# EAGLE design LeftRightTurretLRUD (EAGLE 9.5.1)
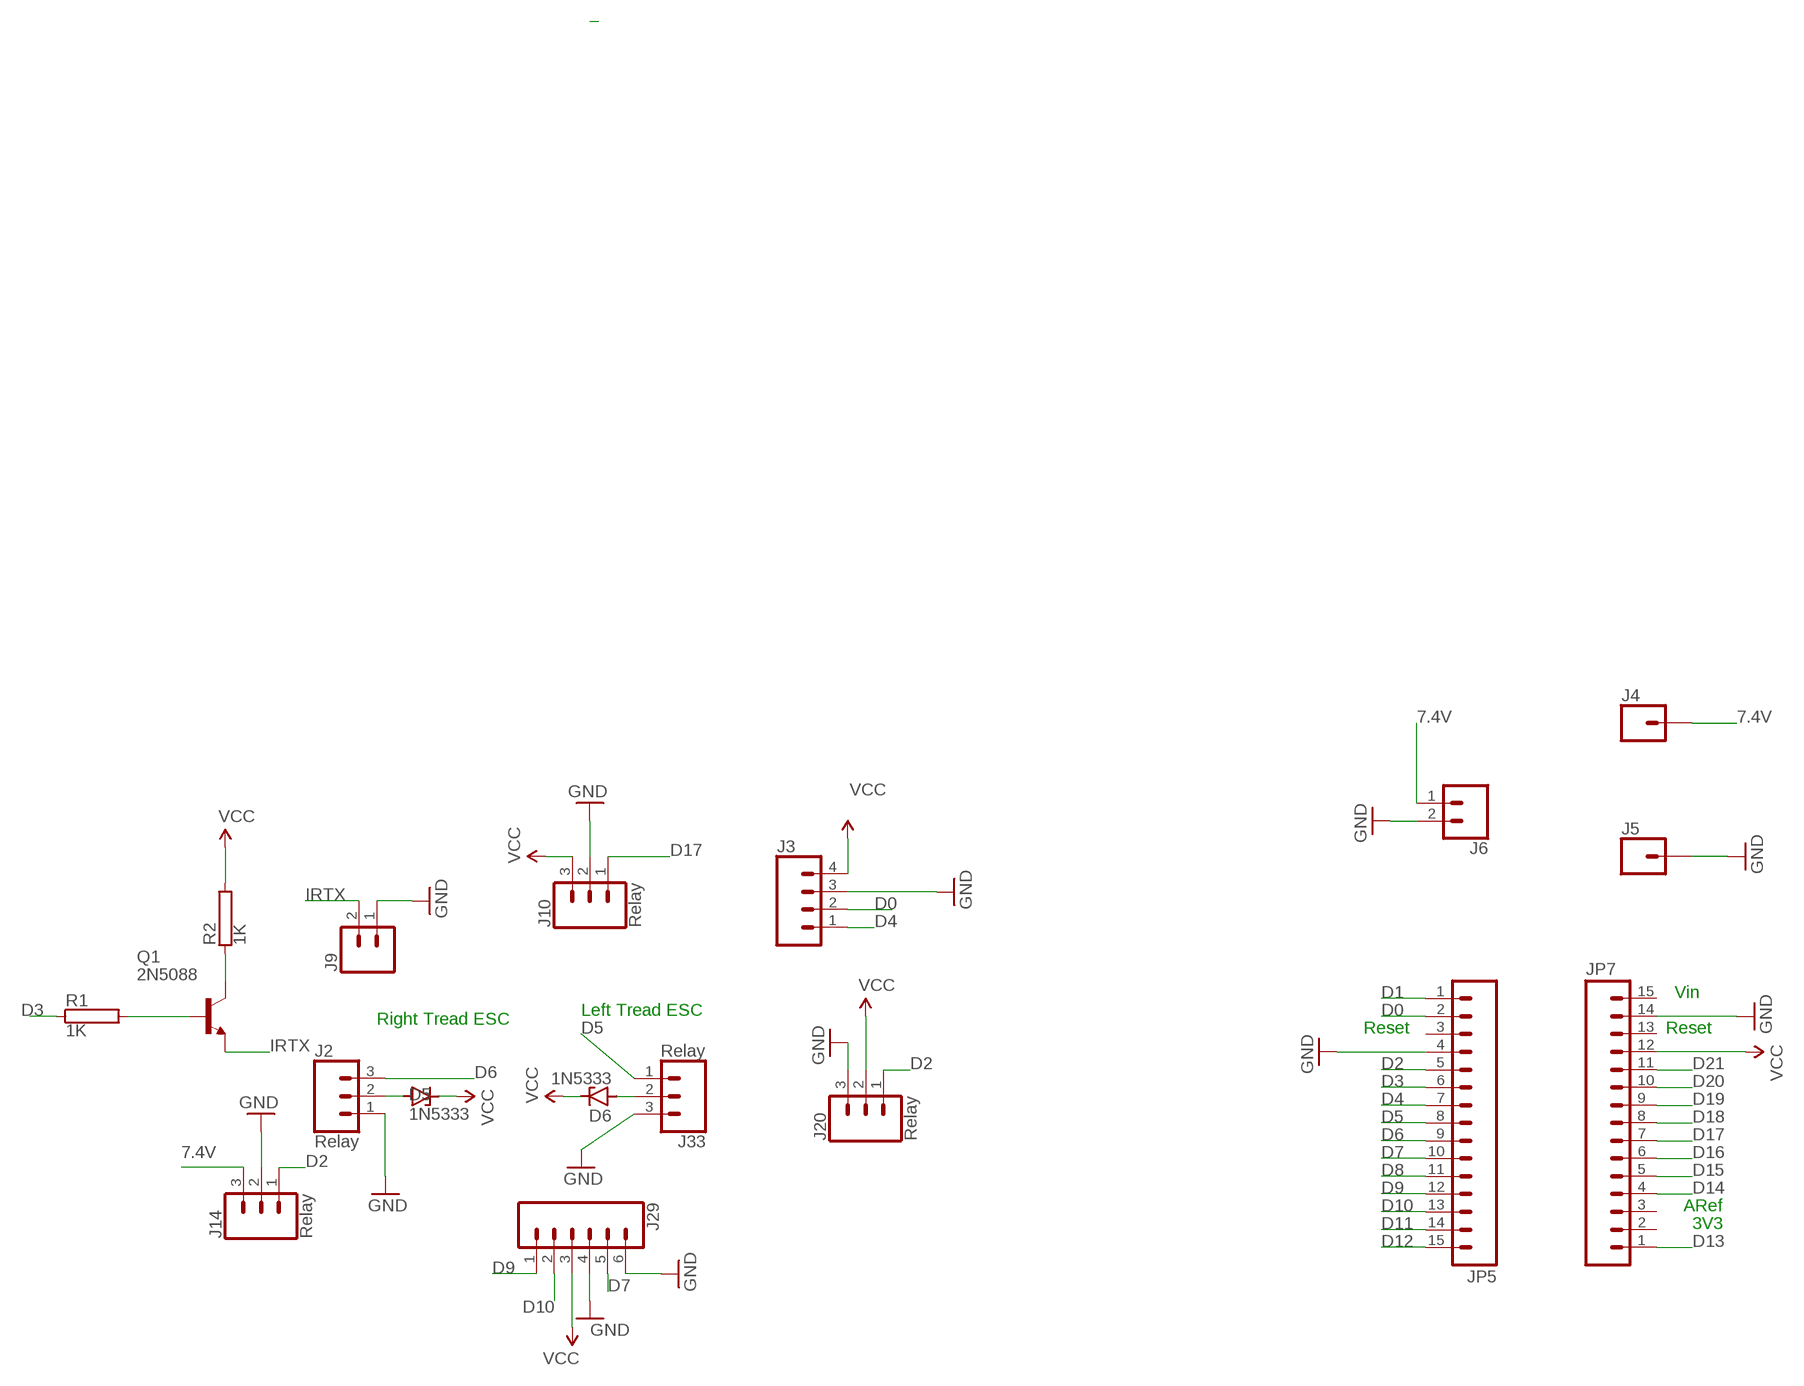
[diagram p0: schematic, sheet 1]

## Parts
D5  1N5333  [C1702-15]
D6  1N5333  [C1702-15]
J2  Relay  CONN_03  [1X03]
J3  CONN_04  [1X04]
J4  CONN_01  [1X01]
J5  CONN_01  [1X01]
J6  CONN_02  [1X02]
J9  CONN_02  [1X02]
J10  Relay  CONN_03  [1X03]
J14  Relay  CONN_03  [1X03]
J20  Relay  CONN_03  [1X03]
J29  CONN_06NO_SILK_FEMALE_PTH  [1X06_NO_SILK]
J33  Relay  CONN_03  [1X03]
JP5  M15  [1X15@1]
JP7  M15  [1X15@1]
Q1  2N5088  [TO92]
R1  1K  RCA0001  [CA0001]
R2  1K  RCA0001  [CA0001]

## Nets
7.4V: J4.1 J6.1 J14.3
D0: J3.2 JP5.2
D1: JP5.1
D2: J14.1 J20.1 JP5.5
D3: JP5.6 R1.1
D4: J3.1 JP5.7
D5: J33.1 JP5.8
D6: J2.3 JP5.9
D7: J29.5 JP5.10
D8: JP5.11
D9: J29.1 JP5.12
D10: J29.2 JP5.13
D11: JP5.14
D12: JP5.15
D13: JP7.1
D14: JP7.4
D15: JP7.5
D16: JP7.6
D17: J10.1 JP7.7
D18: JP7.8
D19: JP7.9
D20: JP7.10
D21: JP7.11
GND [gnd]: J2.1 J3.3 J5.1 J6.2 J9.1 J10.2 J14.2 J20.3 J29.4 J29.6 J33.3 JP5.4 JP7.14
IRTX: J9.2 Q1.3(E)
N$1: Q1.2(B) R1.2
N$3: Q1.1(C) R2.1
N$7: D5.A J2.2
N$8: D6.A J33.2
VCC: D5.C D6.C J3.4 J10.3 J20.2 J29.3 JP7.12 R2.2
Unconnected: JP5.3 JP7.2 JP7.3 JP7.13 JP7.15

## Notes on the sheet
- Vin
- Left Tread ESC
- Right Tread ESC
- Reset | Reset
- ARef
- 3V3

## Library data of the parts
D5 D6 = diode:1N5333: Z DIODE 3.3 V, 5W, 5 percent (Motorola)
J2 J10 J14 J20 J33 = SparkFun-Connectors:CONN_03: Multi connection point. Often used as Generic Header-pin footprint for 0.1 inch spaced/style header connections On any of the 0.1 inch spaced packages, you can populate with these: Break Away Headers - Straight <https://www.sparkfun.com/products/116> (PRT-00116) Break Away Male Headers - Right Angle <https://www.sparkfun.com/products/553> (PRT-00553) Female Headers <https://www.sparkfun.com/products/115> (PRT-00115) Break Away Headers - Machine Pin <https://www.sparkfun.com/products/117> (PRT-00117) Break Away Female Headers - Swiss Machine Pin <https://www.sparkfun.com/products/743> (PRT-00743) Stackable Header - 3 Pin (Female, 0.1") <https://www.sparkfun.com/products/13875> (PRT-13875) For SCREWTERMINALS and SPRING TERMINALS visit here: Screw Terimnals on SparkFun.com <https://www.sparkfun.com/search/results?term=Screw+Terminals> (5mm/3.5mm/2.54mm spacing) This device is also useful as a general connection point to wire up your design to another part of your project. Our various solder wires solder well into these plated through hole pads. Hook-Up Wire - Assortment (Stranded, 22 AWG) <https://www.sparkfun.com/products/11375> (PRT-11375) Hook-Up Wire - Assortment (Solid Core, 22 AWG) <https://www.sparkfun.com/products/11367> (PRT-11367) View the entire wire category on our website here <https://www.sparkfun.com/categories/141> Special notes: Molex polarized connector foot print use with SKU : PRT-08232 with associated crimp pins and housings.; PROD_ID: XXX-00000; VALUE: 455-1750-1-ND
J3 = SparkFun-Connectors:CONN_04: Multi connection point. Often used as Generic Header-pin footprint for 0.1 inch spaced/style header connections On any of the 0.1 inch spaced packages, you can populate with these: Break Away Headers - Straight <https://www.sparkfun.com/products/116> (PRT-00116) Break Away Male Headers - Right Angle <https://www.sparkfun.com/products/553> (PRT-00553) Female Headers <https://www.sparkfun.com/products/115> (PRT-00115) Break Away Headers - Machine Pin <https://www.sparkfun.com/products/117> (PRT-00117) Break Away Female Headers - Swiss Machine Pin <https://www.sparkfun.com/products/743> (PRT-00743) For SCREWTERMINALS and SPRING TERMINALS visit here: Screw Terimnals on SparkFun.com <https://www.sparkfun.com/search/results?term=Screw+Terminals> (5mm/3.5mm/2.54mm spacing) This device is also useful as a general connection point to wire up your design to another part of your project. Our various solder wires solder well into these plated through hole pads. Hook-Up Wire - Assortment (Stranded, 22 AWG) <https://www.sparkfun.com/products/11375> (PRT-11375) Hook-Up Wire - Assortment (Solid Core, 22 AWG) <https://www.sparkfun.com/products/11367> (PRT-11367) View the entire wire category on our website here <https://www.sparkfun.com/categories/141> Special notes: Molex polarized connector foot print use with SKU : PRT-08231 with associated crimp pins and housings. 1MM SMD Version SKU: PRT-10208; PROD_ID: CONN-09696
J4 J5 = SparkFun-Connectors:CONN_01: Single connection point. Often used as Generic Header-pin footprint for 0.1 inch spaced/style header connections On any of the 0.1 inch spaced packages, you can populate with these: Break Away Headers - Straight <https://www.sparkfun.com/products/116> (PRT-00116) Break Away Male Headers - Right Angle <https://www.sparkfun.com/products/553> (PRT-00553) Female Headers <https://www.sparkfun.com/products/115> (PRT-00115) Break Away Headers - Machine Pin <https://www.sparkfun.com/products/117> (PRT-00117) Break Away Female Headers - Swiss Machine Pin <https://www.sparkfun.com/products/743> (PRT-00743) This device is also useful as a general connection point to wire up your design to another part of your project. Our various solder wires solder well into these plated through hole pads. Hook-Up Wire - Assortment (Stranded, 22 AWG) <https://www.sparkfun.com/products/11375> (PRT-11375) Hook-Up Wire - Assortment (Solid Core, 22 AWG) <https://www.sparkfun.com/products/11367> (PRT-11367) View the entire wire category on our website here <https://www.sparkfun.com/categories/141> Special notes: SMTSO-256-ET is a "flush mount" nut for a 4-40 screw. We mostly use this on specialty testbeds; it is a nice way to connect hardware to your PCB at an adjustable hieght. Also note, the SNAP packages are for using a snappable style connector. We sell a baggie of snaps and they are also used on two LilyPad designs: Snap Assortment - 30 pack (male and female) <https://www.sparkfun.com/products/11347> (DEV-11347) LilyPad Arduino SimpleSnap <https://www.sparkfun.com/products/10941> (DEV-10941) LilyPad SimpleSnap Protoboard <https://www.sparkfun.com/products/10940> (DEV-10940)
J6 J9 = SparkFun-Connectors:CONN_02: Multi connection point. Often used as Generic Header-pin footprint for 0.1 inch spaced/style header connections On any of the 0.1 inch spaced packages, you can populate with these: Break Away Headers - Straight <https://www.sparkfun.com/products/116> (PRT-00116) Break Away Male Headers - Right Angle <https://www.sparkfun.com/products/553> (PRT-00553) Female Headers <https://www.sparkfun.com/products/115> (PRT-00115) Break Away Headers - Machine Pin <https://www.sparkfun.com/products/117> (PRT-00117) Break Away Female Headers - Swiss Machine Pin <https://www.sparkfun.com/products/743> (PRT-00743) For SCREWTERMINALS and SPRING TERMINALS visit here: Screw Terimnals on SparkFun.com <https://www.sparkfun.com/search/results?term=Screw+Terminals> (5mm/3.5mm/2.54mm spacing) This device is also useful as a general connection point to wire up your design to another part of your project. Our various solder wires solder well into these plated through hole pads. Hook-Up Wire - Assortment (Stranded, 22 AWG) <https://www.sparkfun.com/products/11375> (PRT-11375) Hook-Up Wire - Assortment (Solid Core, 22 AWG) <https://www.sparkfun.com/products/11367> (PRT-11367) View the entire wire category on our website here <https://www.sparkfun.com/categories/141> Special notes: Molex polarized connector foot print use with: PRT-08233 with associated crimp pins and housings. 2.54_SCREWTERM for use with PRT-10571. 3.5mm Screw Terminal footprints for PRT-08084 5mm Screw Terminal footprints for use with PRT-08432
J29 = SparkFun-Connectors:CONN_06: Multi connection point. Often used as Generic Header-pin footprint for 0.1 inch spaced/style header connections On any of the 0.1 inch spaced packages, you can populate with these: Break Away Headers - Straight <https://www.sparkfun.com/products/116> (PRT-00116) Break Away Male Headers - Right Angle <https://www.sparkfun.com/products/553> (PRT-00553) Female Headers <https://www.sparkfun.com/products/115> (PRT-00115) Break Away Headers - Machine Pin <https://www.sparkfun.com/products/117> (PRT-00117) Break Away Female Headers - Swiss Machine Pin <https://www.sparkfun.com/products/743> (PRT-00743) Arduino Stackable Header - 6 Pin <https://www.sparkfun.com/products/9280> (PRT-09280) For SCREWTERMINALS and SPRING TERMINALS visit here: Screw Terimnals on SparkFun.com <https://www.sparkfun.com/search/results?term=Screw+Terminals> (5mm/3.5mm/2.54mm spacing) This device is also useful as a general connection point to wire up your design to another part of your project. Our various solder wires solder well into these plated through hole pads. Hook-Up Wire - Assortment (Stranded, 22 AWG) <https://www.sparkfun.com/products/11375> (PRT-11375) Hook-Up Wire - Assortment (Solid Core, 22 AWG) <https://www.sparkfun.com/products/11367> (PRT-11367) View the entire wire category on our website here <https://www.sparkfun.com/categories/141>; PROD_ID: CONN-08437
JP5 JP7 = SparkFun-Connectors:M15: Header 15 Standard 15-pin 0.1" header. Use with straight break away headers (SKU : PRT-00116), right angle break away headers (PRT-00553), swiss pins (PRT-00743), machine pins (PRT-00117), and female headers (PRT-00115).
Q1 = transistor-npn:2N5088: NPN Transistor
R1 R2 = resistor-power:R: Power Resitor; OC_FARNELL: unknown; OC_NEWARK: unknown

## Net classes
0 default: width 0.254 mm, clearance 0.254 mm
1 power: width 0.61 mm, drill 0.711 mm, clearance 0.33 mm
2 gnd: width 0.305 mm, drill 0.711 mm, clearance 0.254 mm
3 usbvcc: width 0.508 mm, drill 0.711 mm, clearance 0.254 mm
4 aref: width 0.406 mm

## Board
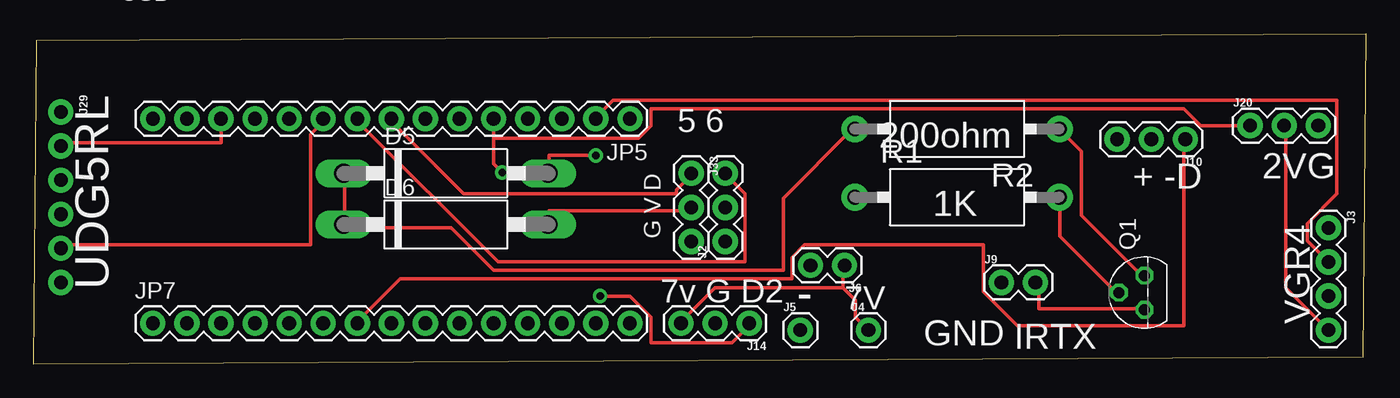
[diagram p1: board, top side]
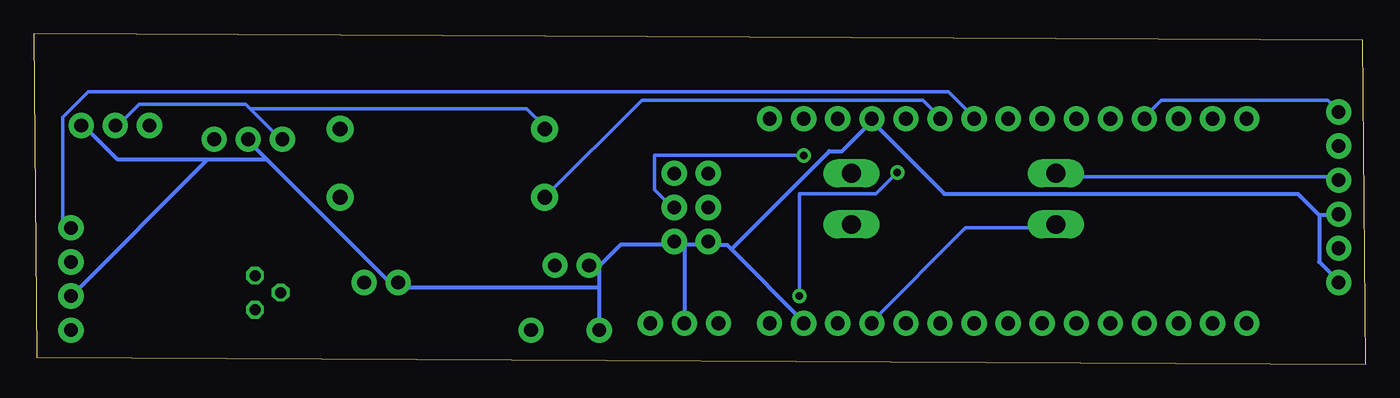
[diagram p2: board, bottom side, seen from below]

Size 99.31 x 24.64 mm. Coordinates in mm from the lower left corner, seen from the top.
Outline: 0.25,24.13 99.31,24.64 99.06,0.51 0,0 0.25,24.13
Copper layers (1*16): Top 0.035mm / dielectric 1.5mm / Bottom 0.035mm
Design rules "default": minimum track width 10mil, minimum drill 22mil, track to track 10mil, track to pad 10mil, pad to pad 10mil, via to via 16mil, smd to smd 8mil, copper to edge 30mil, drill to drill 12mil, minimum pad ring 10mil, minimum via ring 10mil, stop-mask expansion 4mil, vias tented up to drill 0mil, thermal gap 10mil
vRestrict: area 25.4,45.5 to 27.1,49.1; area 33.4,41 to 34.9,44.6; area 35.9,41 to 37.5,44.6; area 38.5,41 to 40,44.6; area 42.5,38.6 to 43.1,38.9

### Footprints (pad centres in the part's own frame; a part is rotated, then mirrored left to right if it is on the bottom)
C1702-15 = drill 1.397 long: A 7.62,0; C -7.62,0
1X03 = drill 1.016 pad 1.88: 1 0,0; 2 2.54,0; 3 5.08,0
1X04 = drill 1.016 pad 1.88: 1 0,0; 2 2.54,0; 3 5.08,0; 4 7.62,0
1X01 = drill 1.016 pad 1.88: 1 0,0
1X02 = drill 1.016 pad 1.88: 1 0,0; 2 2.54,0
1X06_NO_SILK = drill 1.016 pad 1.88: 1 0,0; 2 2.54,0; 3 5.08,0; 4 7.62,0; 5 10.16,0; 6 12.7,0
1X15@1 = drill 1.016 pad 1.88: 1 0,0; 2 2.54,0; 3 5.08,0; 4 7.62,0; 5 10.16,0; 6 12.7,0; 7 15.24,0; 8 17.78,0; 9 20.32,0; 10 22.86,0; 11 25.4,0; 12 27.94,0; 13 30.48,0; 14 33.02,0; 15 35.56,0
TO92 = drill 0.813 octagon: 1 1.27,0; 2 0,1.905; 3 -1.27,0
CA0001 = drill 1.1 pad 2: 1 -7.62,0; 2 7.62,0

### Placement (x,y rotation side)
D5  30.73,14.22 0 top
D6  30.73,10.41 0 top
J2  51.56,9.14 90 top
J3  96.52,10.16 270 top
J4  62.23,2.54 0 top
J5  57.15,2.54 0 top
J6  60.45,7.37 180 top
J9  72.14,6.1 0 top
J10  85.85,16.76 180 top
J14  53.34,3.05 180 top
J20  90.68,17.78 0 top
J29  2.03,18.8 270 top
J33  49.02,14.22 270 top
JP5  44.45,18.29 180 top
JP7  8.89,3.05 0 top
Q1  82.8,5.33 90 top
R1  68.83,12.45 0 top
R2  68.83,17.53 180 top

### Tracks (layer width: path | path; a pad name or v marks a point on that pad's centre or on a via)
7.4V
  Top 0.254: 60.33,5.71 50.8,5.71 48.26,3.17 J14.3 | 60.33,5.71 60.33,7.3 J6.1 | J4.1 61.28,3.49 61.28,4.76 60.33,5.71
D0
  Top 0.254: J3.2 94.93,9.21 94.93,10.48 97.16,12.7 97.16,19.68 43.18,19.68 41.91,18.41 JP5.2
D2  (via drill 0.56)
  Top 0.254: v42.23,5.08 44.45,5.08 46.04,3.49 46.04,1.59 52.07,1.59 53.34,2.86 J14.1 | v34.92,14.29 34.29,14.92 34.29,16.83 | JP5.5 34.29,16.83 | J20.1 87,17.78 85.72,19.05 46.04,19.05 46.04,17.78 45.09,16.83 34.29,16.83
  Bottom 0.254: v42.23,5.08 42.23,12.7 36.51,12.7 v34.92,14.29
D3
  Bottom 0.254: R1.1 53.98,19.68 33.02,19.68 31.75,18.41 JP5.6
D4
  Bottom 0.254: J3.1 97.16,10.16 97.16,18.41 95.25,20.32 31.11,20.32 29.21,18.41 JP5.7
D5
  Top 0.254: JP5.8 26.67,18.1 32.07,12.7 47.94,12.7 47.94,13.02 48.9,13.97 J33.1
D6
  Top 0.254: JP5.9 24.13,18.1 34.61,7.62 53.02,7.62 53.02,12.7 51.75,13.97 J2.3
D7
  Top 0.254: J29.5 2.22,8.89 20.64,8.89 20.64,17.14 21.59,18.1 JP5.10
D9
  Bottom 0.254: J29.1 2.22,19.05 2.86,19.68 15.24,19.68 16.51,18.41 JP5.12
D10
  Top 0.254: JP5.13 13.97,16.51 2.22,16.51 J29.2
D17
  Top 0.254: JP7.7 24.13,3.17 27.3,6.35 56.52,6.35 56.52,7.94 57.47,8.89 70.8,8.89 70.8,5.4 73.34,2.86 85.72,2.86 85.72,16.51 J10.1
GND
  Bottom 0.305: 57.15,7.3 57.15,5.71 | 57.15,5.71 J5.1 | 57.15,7.3 57.78,7.3 J6.2 57.15,7.3 | 57.15,5.71 71.75,5.71 J9.1 72.39,6.35 73.03,6.35 81.92,15.24 | 81.92,15.24 83.19,16.51 J10.2 | 81.92,15.24 86.36,15.24 | 86.36,15.24 93.03,15.24 95.57,17.78 J20.3 | 86.36,15.24 J3.3 | 50.8,8.89 J14.2 | 50.8,8.89 51.44,8.89 J2.1 | 3.49,11.11 3.49,7.62 2.22,6.35 J29.6 | 3.49,11.11 2.22,11.11 J29.4 | 47.31,8.57 47.62,8.89 48.9,8.89 J33.3 49.21,8.89 50.8,8.89 | 47.31,8.57 41.91,3.17 JP7.14 | 36.83,18.1 39.05,15.88 40.01,15.88 47.31,8.57 | 3.49,11.11 5.08,12.7 31.43,12.7 36.83,18.1 | 36.83,18.1 JP5.4 | 50.8,8.89 J2.1 | 57.15,7.3 55.56,8.89 51.75,8.89 J2.1
IRTX
  Top 0.254: Q1.3 82.55,4.13 74.93,4.13 74.93,6.03 J9.2
N$1
  Top 0.254: Q1.2 80.64,5.4 76.52,9.53 76.52,12.38 R1.2
N$3
  Top 0.254: R2.1 78.11,15.88 78.11,11.11 82.55,6.67 Q1.1
N$7  (via drill 0.56)
  Top 0.254: v41.91,15.56 38.42,15.56 38.42,14.29 D5.A
  Bottom 0.254: v41.91,15.56 53.02,15.56 53.02,13.02 51.75,11.75 J2.2
N$8
  Top 0.254: J33.2 48.9,11.43 38.42,11.43 38.42,10.48 D6.A
VCC
  Top 0.254: D5.C 23.18,13.97 23.18,10.48 D6.C 23.18,10.16 31.11,10.16 34.29,6.99 55.88,6.99 55.88,12.38 60.96,17.46 R2.2 | J3.4 93.34,5.71 93.34,17.78 J20.2
  Bottom 0.254: JP7.12 36.83,3.17 29.84,10.16 23.18,10.16 D6.C | J29.3 2.22,13.97 22.86,13.97 D5.C | 83.19,19.05 83.5,19.37 91.44,19.37 93.03,17.78 J20.2 | 83.19,19.05 80.96,16.83 J10.3 | 83.19,19.05 62.55,19.05 61.28,17.78 R2.2

### Text on the board
tNames: 3 2 1 0 9 8 | GND | 1 1 1 1 | AREF | PWM | PWM | PWM | USB
Reference: C8 | C2 | R11 | C4 | C5
_tsilk: 200ohm | 5 6 | 2VG | + -D | G V D | 1K | VGR4 | UDG5RL | 7v G D2 | - | 7V | GND | IRTX